# Altium schematic sheet Main.SchDoc
size A4; SheetNumber: 1; SheetTotal: 8
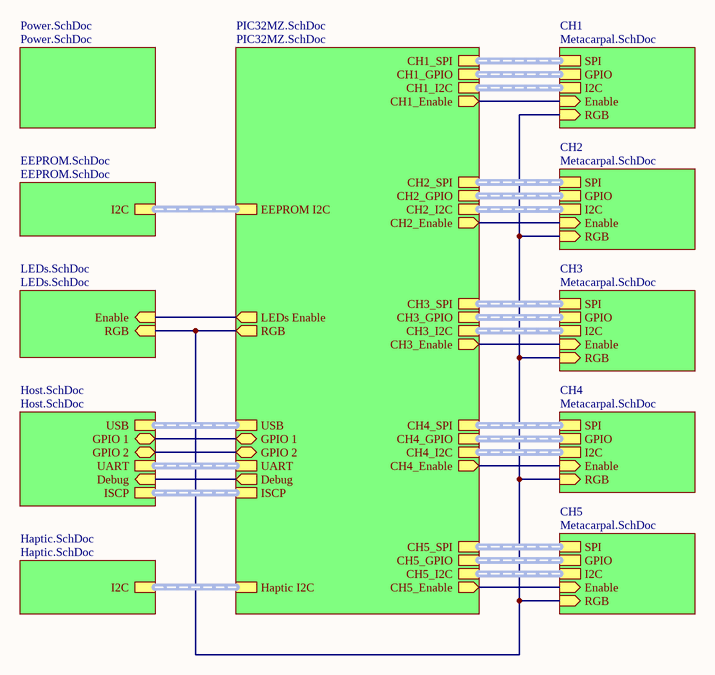
[diagram p0: Main.SchDoc]

## Sub-sheets
CH1 = Metacarpal.SchDoc: I2C (harness I2C), SPI (harness SPI), GPIO (harness GPIO), RGB (in), Enable (in)
CH2 = Metacarpal.SchDoc: I2C (harness I2C), SPI (harness SPI), GPIO (harness GPIO), RGB (in), Enable (in)
CH3 = Metacarpal.SchDoc: I2C (harness I2C), SPI (harness SPI), GPIO (harness GPIO), RGB (in), Enable (in)
CH4 = Metacarpal.SchDoc: I2C (harness I2C), SPI (harness SPI), GPIO (harness GPIO), RGB (in), Enable (in)
CH5 = Metacarpal.SchDoc: I2C (harness I2C), SPI (harness SPI), GPIO (harness GPIO), RGB (in), Enable (in)
EEPROM.SchDoc = EEPROM.SchDoc: I2C (harness I2C)
Haptic.SchDoc = Haptic.SchDoc: I2C (harness I2C)
Host.SchDoc = Host.SchDoc: UART (harness UART), USB (harness USB), ISCP (harness ICSP), Debug (in), GPIO 1 (bidir), GPIO 2 (bidir)
LEDs.SchDoc = LEDs.SchDoc: RGB (in), Enable (in)
PIC32MZ.SchDoc = PIC32MZ.SchDoc: EEPROM I2C (harness I2C), Haptic I2C (harness I2C), CH1_SPI (harness SPI), CH1_GPIO (harness GPIO), CH1_I2C (harness I2C), CH2_SPI (harness SPI), CH2_GPIO (harness GPIO), CH2_I2C (harness I2C), CH3_SPI (harness SPI), CH3_GPIO (harness GPIO), CH3_I2C (harness I2C), CH4_SPI (harness SPI), CH4_GPIO (harness GPIO), CH4_I2C (harness I2C), CH5_SPI (harness SPI), CH5_GPIO (harness GPIO), CH5_I2C (harness I2C), UART (harness UART), USB (harness USB), ISCP (harness ICSP), RGB (out), LEDs Enable (out), CH1_Enable (out), CH2_Enable (out), CH5_Enable (out), CH4_Enable (out), CH3_Enable (out), Debug (out), GPIO 2 (bidir), GPIO 1 (bidir)
Power.SchDoc = Power.SchDoc: no entries

## Nets
(unnamed): sheet PIC32MZ.SchDoc/RGB, sheet CH1/RGB, sheet LEDs.SchDoc/RGB, sheet CH2/RGB, sheet CH3/RGB, sheet CH4/RGB, sheet CH5/RGB
(unnamed): sheet PIC32MZ.SchDoc/LEDs Enable, sheet LEDs.SchDoc/Enable
(unnamed): sheet PIC32MZ.SchDoc/CH1_Enable, sheet CH1/Enable
(unnamed): sheet PIC32MZ.SchDoc/CH2_Enable, sheet CH2/Enable
(unnamed): sheet PIC32MZ.SchDoc/CH5_Enable, sheet CH5/Enable
(unnamed): sheet PIC32MZ.SchDoc/CH4_Enable, sheet CH4/Enable
(unnamed): sheet PIC32MZ.SchDoc/CH3_Enable, sheet CH3/Enable
(unnamed): sheet PIC32MZ.SchDoc/Debug, sheet Host.SchDoc/Debug
(unnamed): sheet PIC32MZ.SchDoc/GPIO 2, sheet Host.SchDoc/GPIO 2
(unnamed): sheet PIC32MZ.SchDoc/GPIO 1, sheet Host.SchDoc/GPIO 1

## Buses and harness runs
harness sheet CH1/GPIO = sheet PIC32MZ.SchDoc/CH1_GPIO
harness sheet CH1/I2C = sheet PIC32MZ.SchDoc/CH1_I2C
harness sheet CH1/SPI = sheet PIC32MZ.SchDoc/CH1_SPI
harness sheet CH2/GPIO = sheet PIC32MZ.SchDoc/CH2_GPIO
harness sheet CH2/I2C = sheet PIC32MZ.SchDoc/CH2_I2C
harness sheet CH2/SPI = sheet PIC32MZ.SchDoc/CH2_SPI
harness sheet CH3/GPIO = sheet PIC32MZ.SchDoc/CH3_GPIO
harness sheet CH3/I2C = sheet PIC32MZ.SchDoc/CH3_I2C
harness sheet CH3/SPI = sheet PIC32MZ.SchDoc/CH3_SPI
harness sheet CH4/GPIO = sheet PIC32MZ.SchDoc/CH4_GPIO
harness sheet CH4/I2C = sheet PIC32MZ.SchDoc/CH4_I2C
harness sheet CH4/SPI = sheet PIC32MZ.SchDoc/CH4_SPI
harness sheet CH5/GPIO = sheet PIC32MZ.SchDoc/CH5_GPIO
harness sheet CH5/I2C = sheet PIC32MZ.SchDoc/CH5_I2C
harness sheet CH5/SPI = sheet PIC32MZ.SchDoc/CH5_SPI
harness sheet EEPROM.SchDoc/I2C = sheet PIC32MZ.SchDoc/EEPROM I2C
harness sheet Haptic.SchDoc/I2C = sheet PIC32MZ.SchDoc/Haptic I2C
harness sheet Host.SchDoc/ISCP = sheet PIC32MZ.SchDoc/ISCP
harness sheet Host.SchDoc/UART = sheet PIC32MZ.SchDoc/UART
harness sheet Host.SchDoc/USB = sheet PIC32MZ.SchDoc/USB

## Notes on the sheet
- TITLE
- SIZE
- A4
- VARIANT
- PROJECT
- SHEET
- VERSION
- OF
- AUTHOR
- DATE